# Altium schematic sheet ToneReal_Adapter_EE.SchDoc
size A3
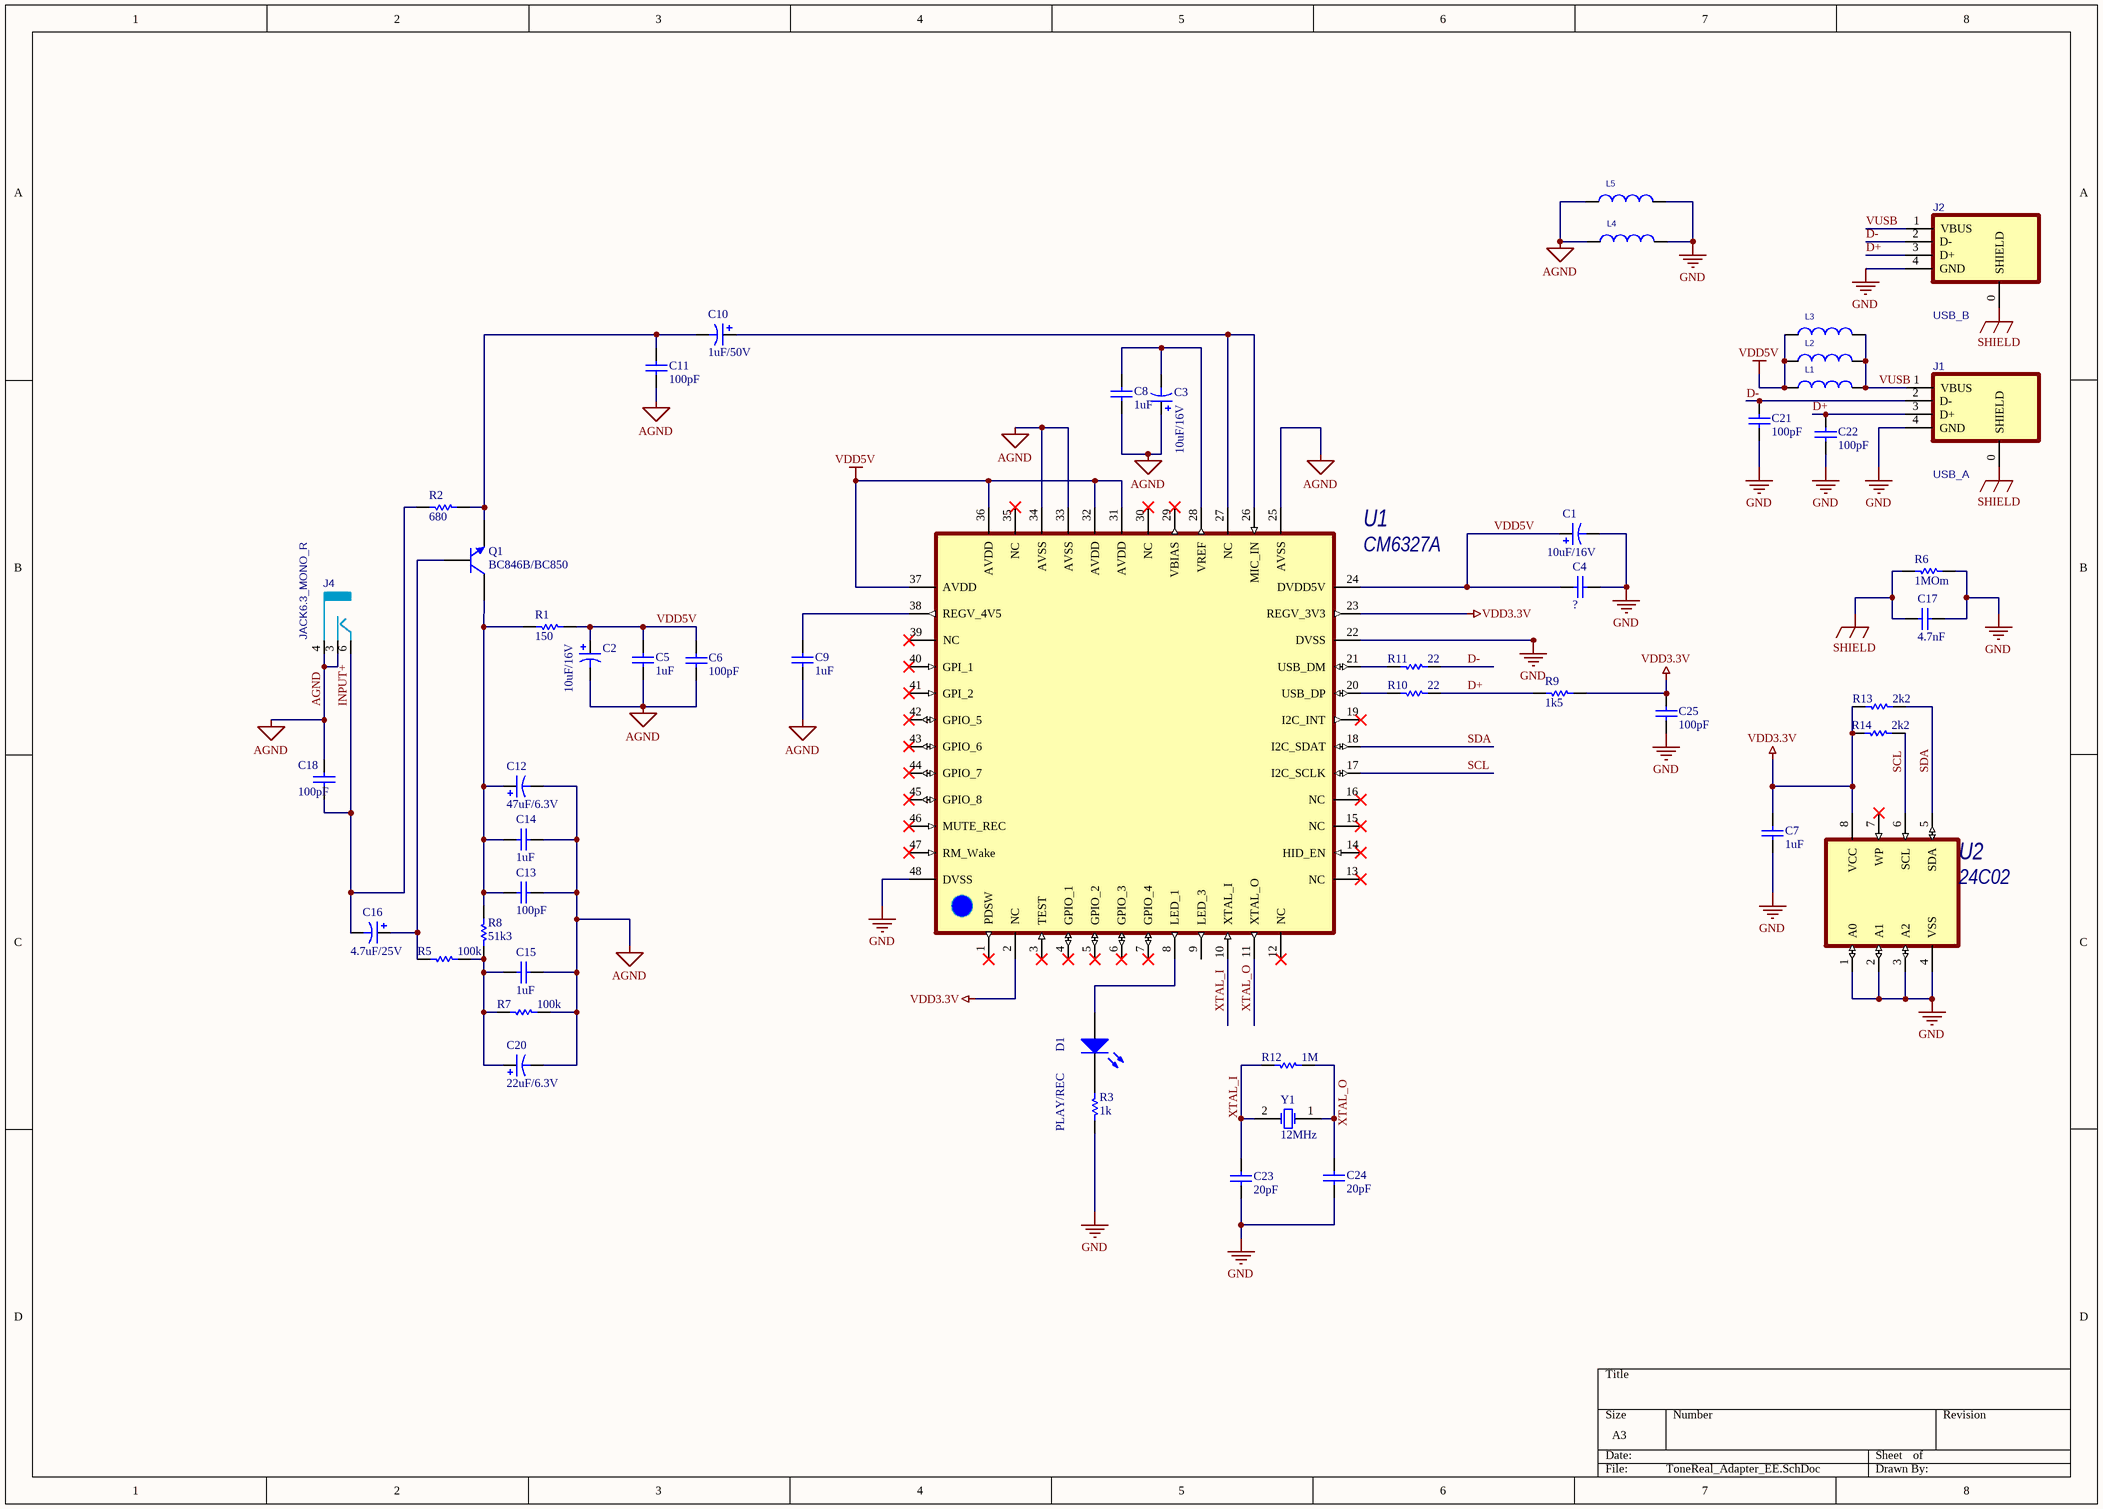
[diagram p0: ToneReal_Adapter_EE.SchDoc]

## Parts
C1  10uF/16V  [TECAP SMD_B (IPC-3528)]
C2  10uF/16V  [TECAP SMD_B (IPC-3528)]
C3  10uF/16V  [TECAP SMD_B (IPC-3528)]
C4  ?  [CERCAP SMD0603L (IPC1608L)]
C5  1uF  [CERCAP SMD0603L (IPC1608L)]
C6  100pF  [CERCAP SMD0603L (IPC1608L)]
C7  1uF  [CERCAP SMD0603L (IPC1608L)]
C8  1uF  [CERCAP SMD0603L (IPC1608L)]
C9  1uF  [CERCAP SMD0603L (IPC1608L)]
C10  1uF/50V  [ECAP SMD KVE 5.0x5.3]
C11  100pF  [CERCAP SMD0603L (IPC1608L)]
C12  47uF/6.3V  [ECAP SMD KVE 5.0x5.3]
C13  100pF  [CERCAP SMD0603L (IPC1608L)]
C14  1uF  [CERCAP SMD0603L (IPC1608L)]
C15  1uF  [CERCAP SMD0603L (IPC1608L)]
C16  4.7uF/25V  [ECAP SMD KVE 5.0x5.3]
C17  4.7nF  [CERCAP SMD0603L (IPC1608L)]
C18  100pF  [CERCAP SMD0603L (IPC1608L)]
C20  22uF/6.3V  [ECAP SMD KVE 5.0x5.3]
C21  100pF  [CERCAP SMD0603L (IPC1608L)]
C22  100pF  [CERCAP SMD0603L (IPC1608L)]
C23  20pF  [CERCAP SMD0603L (IPC1608L)]
C24  20pF  [CERCAP SMD0603L (IPC1608L)]
C25  100pF  [CERCAP SMD0603L (IPC1608L)]
D1  PLAY/REC  [SMDLED_0805]
J1  USB_A  [USBA_1PLAG]
J2  USB_B  [USB-B]
J4  JACK6.3_MONO_R  [JACK6.3]
L1  BLM21PG221SN1  [BLM21P (0805 size)]  (value not drawn)
L2  BLM21PG221SN1  [BLM21P (0805 size)]  (value not drawn)
L3  BLM21PG221SN1  [BLM21P (0805 size)]  (value not drawn)
L4  BLM21PG221SN1  [BLM21P (0805 size)]  (value not drawn)
L5  BLM21PG221SN1  [BLM21P (0805 size)]  (value not drawn)
Q1  BC846B/BC850  [SOT_23]
R1  150  [RES smd0603 (IPC-1608)]
R2  680  [RES smd0603 (IPC-1608)]
R3  1k  [RES smd0603 (IPC-1608)]
R5  100k  [RES smd0603 (IPC-1608)]
R6  1MOm  [RES smd0603 (IPC-1608)]
R7  100k  [RES smd0603 (IPC-1608)]
R8  51k3  [RES smd0603 (IPC-1608)]
R9  1k5  [RES smd0603 (IPC-1608)]
R10  22  [RES smd0603 (IPC-1608)]
R11  22  [RES smd0603 (IPC-1608)]
R12  1M  [RES smd0603 (IPC-1608)]
R13  2k2  [RES smd0603 (IPC-1608)]
R14  2k2  [RES smd0603 (IPC-1608)]
U1  CM6327A  [QFP50P900X900X160-48N]
U2  24C02  [SOIC-8]
Y1  12MHz  [HC-49/U3H  (KX-3H)]

## Nets
AGND: C2.2 C3.1 C5.2 C6.2 C8.2 C9.2 C11.2 C12.2 C13.1 C14.1 C15.1 C18.2 C20.2 J4.3(R_ch_closed) J4.4(GND) L4.1 L5.1 R7.2 U1.25(AVSS) U1.33(AVSS) U1.34(AVSS)
GND: C1.2 C4.1 C7.1 C17.2 C21.1 C22.1 C23.1 C24.1 C25.1 J1.4(GND) J2.4(GND) L4.2 L5.2 R3.2 R6.1 U1.22(DVSS) U1.48(DVSS) U2.1(A0) U2.2(A1) U2.3(A2) U2.4(VSS)
SHIELD: C17.1 J1.0(SHIELD) J2.0(SHIELD) R6.2
VDD3.3V: C7.2 C25.2 R9.1 R13.1 R14.1 U1.2(NC) U1.23(REGV_3V3) U2.8(VCC)
VDD5V: C1.1 C2.1 C4.2 C5.1 C6.1 L1.1 L2.1 L3.1 R1.1 U1.24(DVDD5V) U1.31(AVDD) U1.32(AVDD) U1.36(AVDD) U1.37(AVDD)
D+: C22.2 J1.3(D+) J2.3(D+) R9.2 R10.2
D-: C21.2 J1.2(D-) J2.2(D-) R11.2
INPUT+: C16.2 C18.1 J4.6(R_CH) R2.1
SCL: R14.2 U1.17(I2C_SCLK) U2.6(SCL)
SDA: R13.2 U1.18(I2C_SDAT) U2.5(SDA)
VUSB: J1.1(VBUS) J2.1(VBUS) L1.2 L2.2 L3.2
XTAL_I: C23.2 R12.1 U1.10(XTAL_I) Y1.2(OSC2)
XTAL_O: C24.2 R12.2 U1.11(XTAL_O) Y1.1(OSC1)
NetC3_2: C3.2 C8.1 U1.28(VREF)
NetC9_1: C9.1 U1.38(REGV_4V5)
NetC10_1: C10.1 U1.26(MIC_IN) U1.27(NC)
NetC10_2: C10.2 C11.1 Q1.2(E) R2.2
NetC12_1: C12.1 C13.2 C14.2 Q1.3(C) R1.2 R8.2
NetC15_2: C15.2 C20.1 R5.2 R7.1 R8.1
NetC16_1: C16.1 Q1.1(B) R5.1
NetD1_1: D1.1(K) R3.1
NetD1_2: D1.2(A) U1.8(LED_1)
NetR10_1: R10.1 U1.20(USB_DP)
NetR11_1: R11.1 U1.21(USB_DM)

Not connected (* = marked no-connect by the designer): U1 1(PDSW)* 3(TEST)* 4(GPIO_1)* 5(GPIO_2)* 6(GPIO_3)* 7(GPIO_4)* 9(LED_3) 12(NC)* 13(NC)* 14(HID_EN)* 15(NC)* 16(NC)* 19(I2C_INT)* 29(VBIAS)* 30(NC)* 35(NC)* 39(NC)* 40(GPI_1)* 41(GPI_2)* 42(GPIO_5)* 43(GPIO_6)* 44(GPIO_7)* 45(GPIO_8)* 46(MUTE_REC)* 47(RM_Wake)*; U2 7(WP)*

## Library data of the parts
C1-C3 C10 C12 C16 C20 = Cap Pol3: Polarized Capacitor (Surface Mount); Published: 8-Jun-2000; LatestRevisionDate: 29-May-2009; LatestRevisionNote: IPC-7351 Footprint Added.; PackageReference: C0805; Publisher: Altium Limited; PackageDescription: Chip Capacitor
  C1-C3: Value: 10uF/16V
  C10: Value: 1uF/50V
  C12: Value: 47uF/6.3V
  C16: Value: 4.7uF/25V
  C20: Value: 22uF/6.3V
C4-C9 C11 C13-C15 C17 C18 C21-C25 = Cap Semi: Capacitor (Semiconductor SIM Model); Published: 8-Jun-2000; LatestRevisionDate: 29-May-2009; LatestRevisionNote: IPC-7351 Footprint Added.; PackageReference: C1206; Publisher: Altium Limited; PackageDescription: Chip Capacitor
  C4: Value: ?
  C5 C7-C9 C14 C15: Value: 1uF
  C6 C11 C13 C18 C21 C22 C25: Value: 100pF
  C17: Value: 4.7nF
  C23 C24: Value: 20pF
D1 = LED0: Typical INFRARED GaAs LED; Published: 8-Jun-2000; LatestRevisionDate: 08-Jul-2005; LatestRevisionNote: Mech Layer 1 removed.; PackageReference: LED-0; Publisher: Altium Limited
J1 J2 = USB: BOM_Manufacturer: SOFNG; BOM_Manufacturer Part: USB-B01; Contributor: LCSC; BOM_Supplier: LCSC; BOM_Supplier Part: C498173; BOM_JLCPCB Part Class: Extended Part; spicePre: U; spiceSymbolName: USB-B01
J4 = JACK6.3_MONO_R: 6.3_jack_mono; spicePre: U; spiceSymbolName: JACK6.3_MONO_R
L1-L5 = INDUCT
Q1 = BC846B: NPN Bipolar Transistor; pin to pad: 1>2 2>3 3>1; CompAuthor: Kungurcev.K.
R1-R3 R5-R14 = RES: Resistor; comment2: smd 0805 1%; Published: 8-Jun-2000; LatestRevisionDate: 17-Jul-2002; LatestRevisionNote: Re-released for DXP Platform.; PackageReference: AXIAL-0.3; Publisher: Altium Limited
  R1: Value: 150
  R2: Value: 680
  R3: Value: 1k
  R5 R7: Value: 100k
  R6: Value: 1MOm
  R8: Value: 51k3
  R9: Value: 1k5
  R10 R11: Value: 22
  R12: Value: 1M
  R13 R14: Value: 2k2
U1 = CM6327_1: CM6327
Y1 = XTAL: Crystal Oscillator; comment2: HC-49S; Published: 8-Jun-2000; LatestRevisionDate: 17-Jul-2002; LatestRevisionNote: Re-released for DXP Platform.; PackageReference: R38; Publisher: Altium Limited